# Altium schematic sheet EP1C6T144I8N.SchDoc: Sonar 4.4
size A2; ApprovedBy: Логвиненко; CheckedBy: Левинец; Author: Спеян; CompanyName: Garage; DrawnBy: 16; Engineer: ,; Organization: Device for; Address1: Protect During; Address2: a Zombie; Address3: Apocalypse; Address4: ....; DocumentNumber: Garage; Revision: 25; SheetNumber: 1; SheetTotal: 1; Scale: 1:1; Title2str: Сонар; ProcessInspection: EP1C6T144I8N.SchDoc; NormInspection: ,; Letter1Column: S; Letter2Column: -; Letter3Column: -; DocumentType: Схема електрическая принципиальная; Mass: .; FirstReferrence: SDE 525.1 111 017 ME; Grupa: gr. E-111; Time: Garage; Rule: 26; ImagePath: 18; Application_BuildNumber: 5
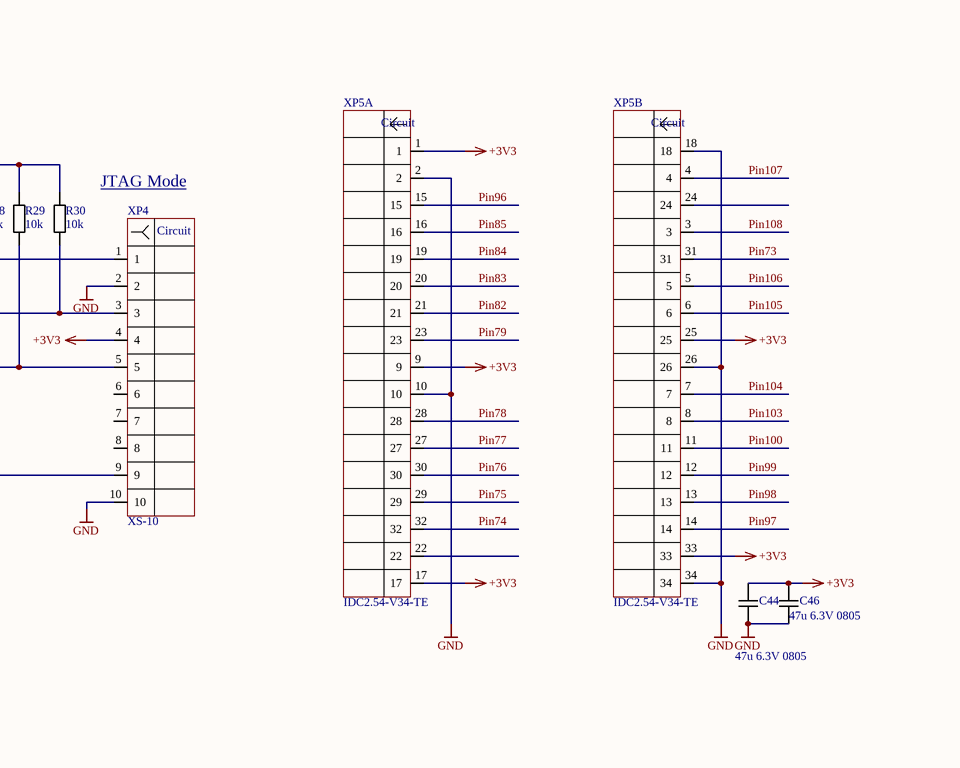
[diagram p0: EP1C6T144I8N.SchDoc, top right]
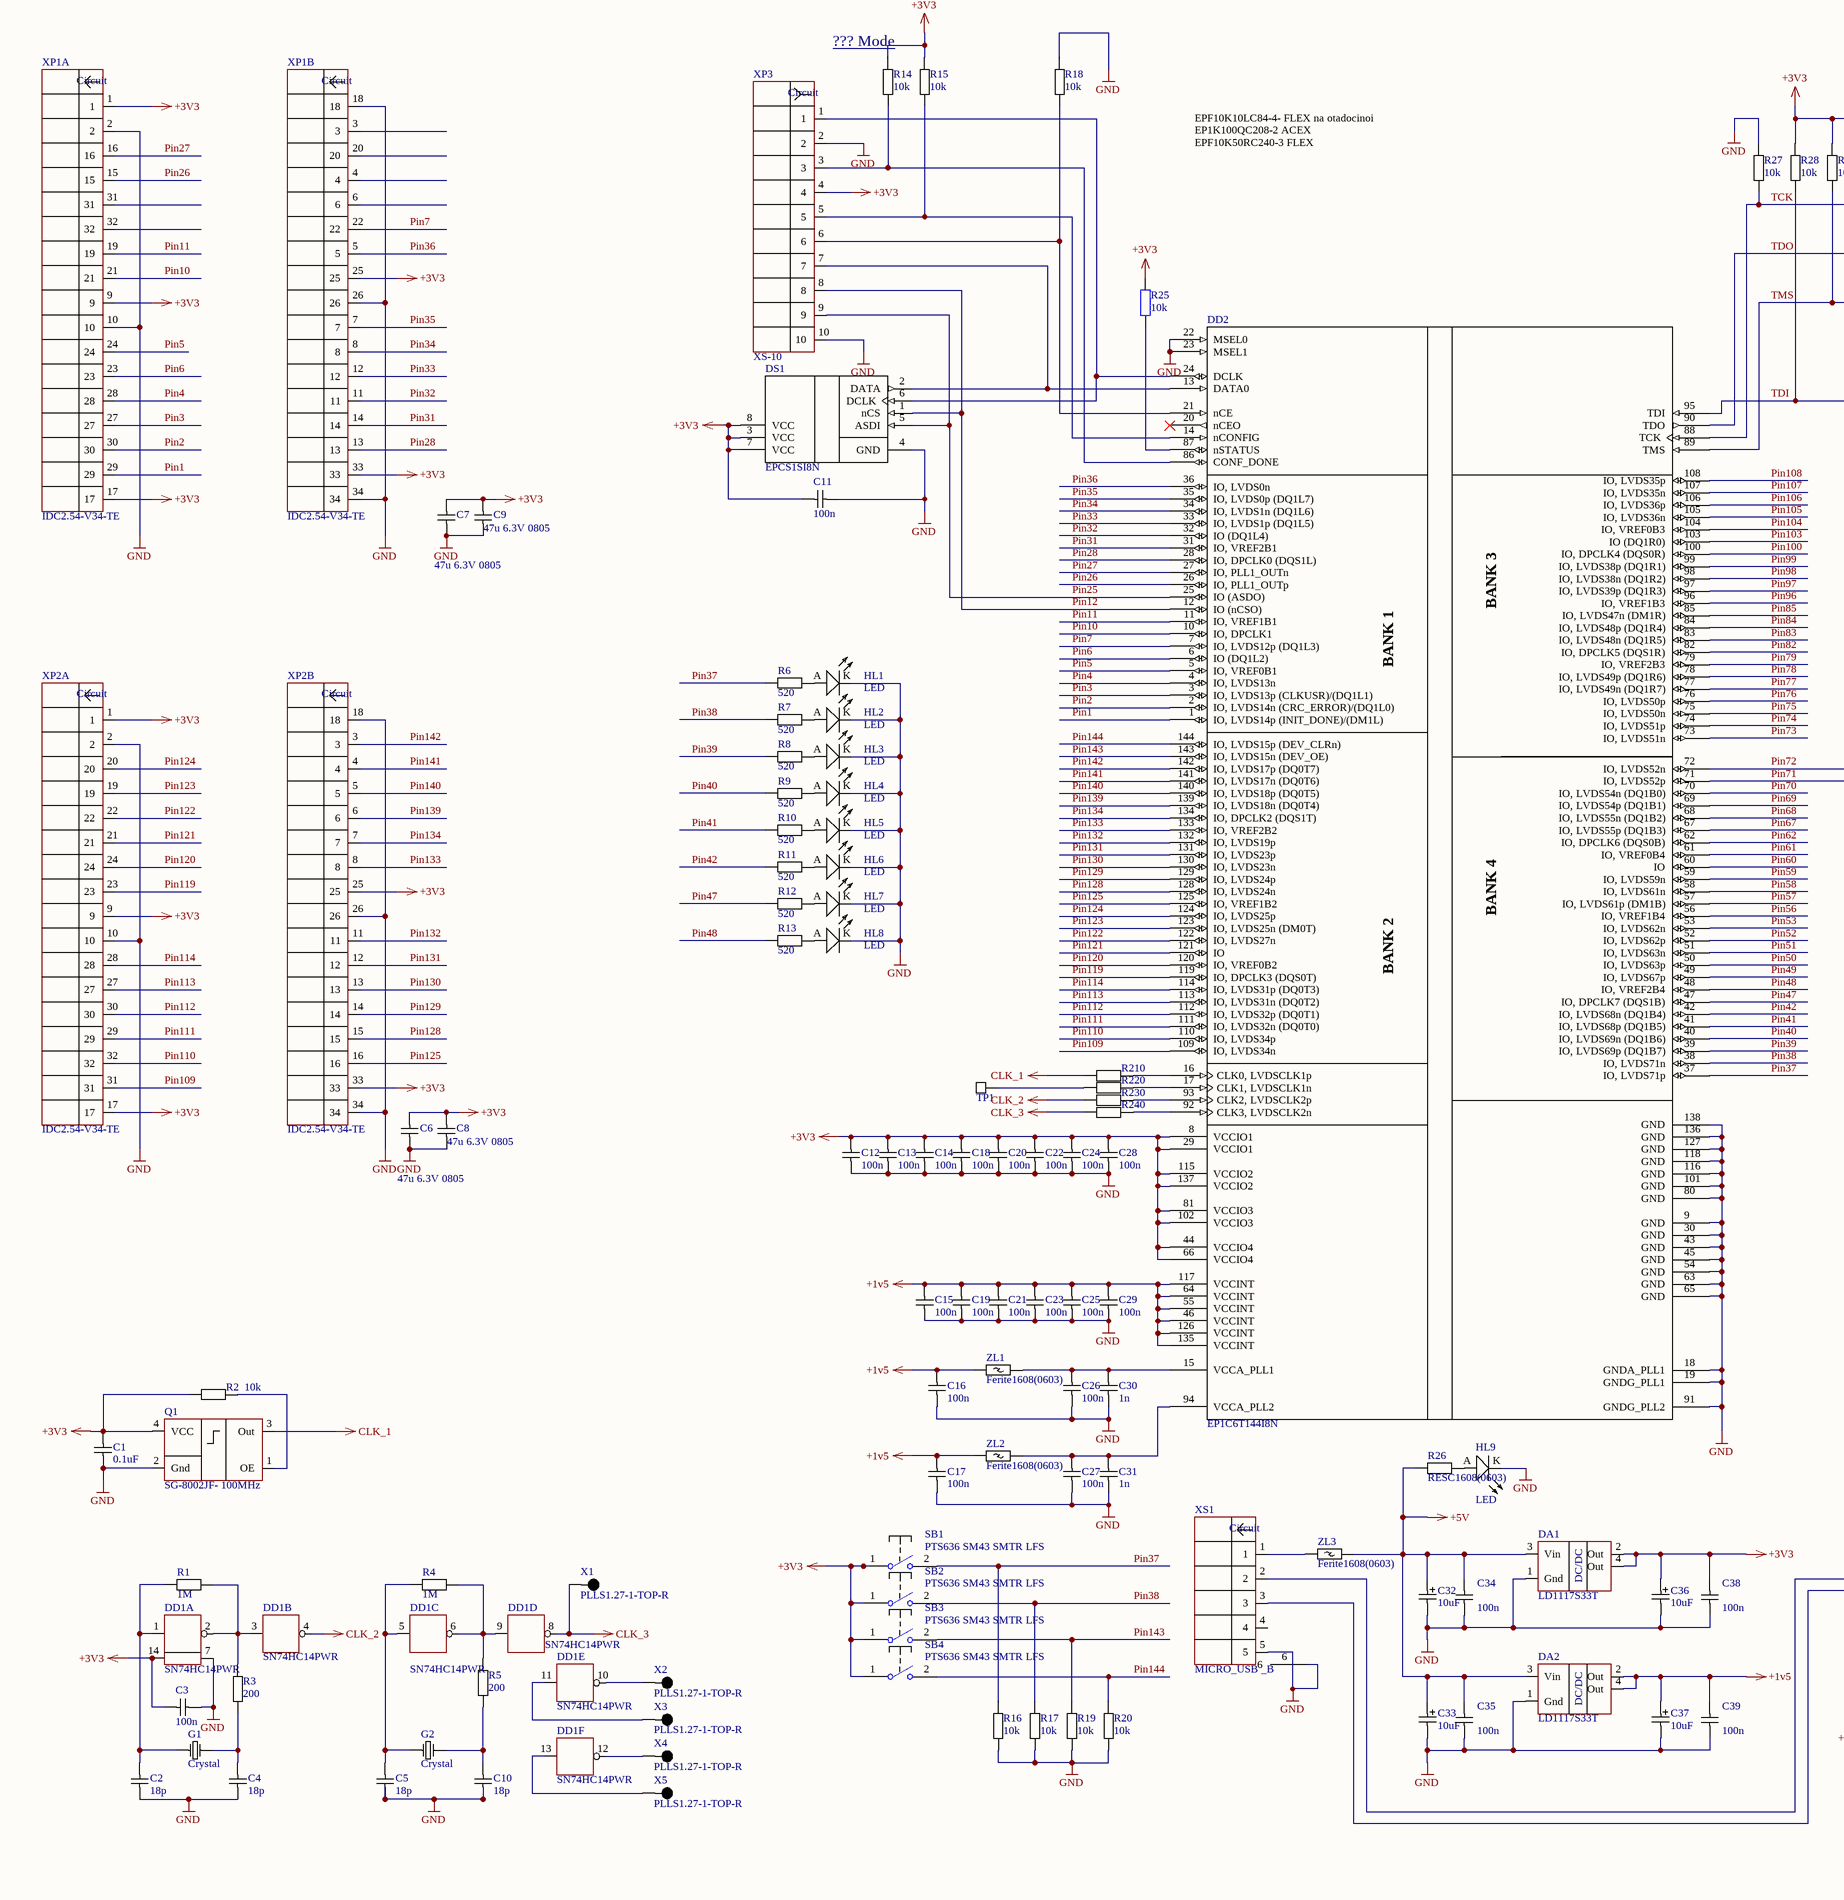
[diagram p1: EP1C6T144I8N.SchDoc, bottom left]
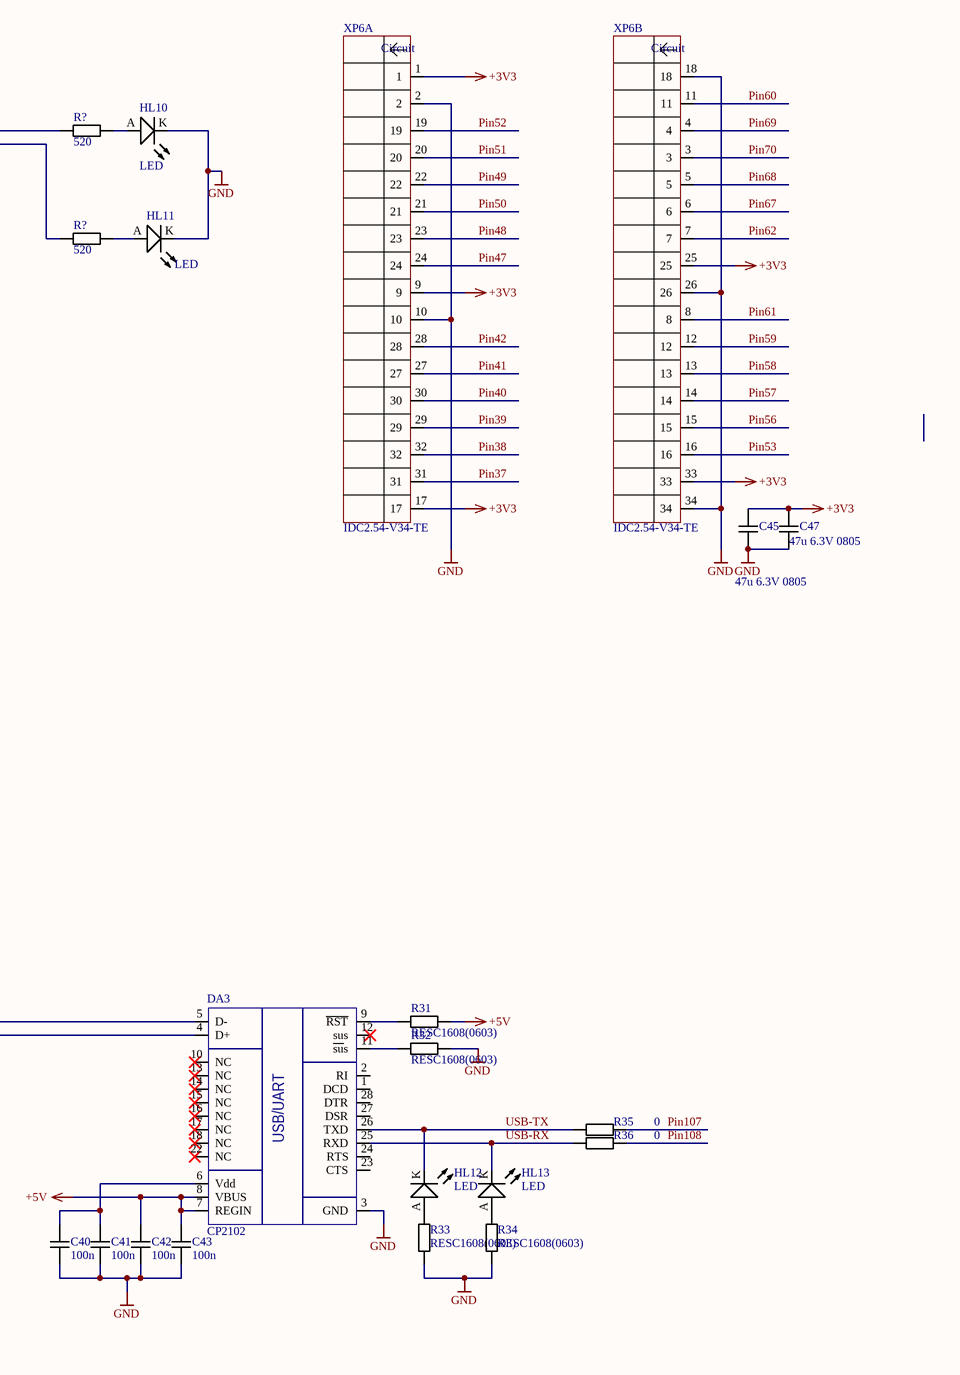
[diagram p2: EP1C6T144I8N.SchDoc, bottom right]

## Parts
(Parts that share a designator on the sheet are numbered #1, #2 ... from top to bottom, then left to right.)
C1  0.1uF  [CapKemet1005(0402)]
C2  18p  [CAPC1608(0603)N]
C3  100n  [CAPC1608(0603)N]
C4  18p  [CAPC1608(0603)N]
C5  18p  [CAPC1608(0603)N]
C6  47u 6.3V 0805  [CAPC2012(0805)N]
C7  47u 6.3V 0805  [CAPC2012(0805)N]
C8  47u 6.3V 0805  [CAPC2012(0805)N]
C9  47u 6.3V 0805  [CAPC2012(0805)N]
C10  18p  [CAPC1608(0603)N]
C11  100n  [CapKemet1005(0402)]
C12  100n  [CapKemet1005(0402)]
C13  100n  [CapKemet1005(0402)]
C14  100n  [CapKemet1005(0402)]
C15  100n  [CapKemet1005(0402)]
C16  100n  [CapKemet1005(0402)]
C17  100n  [CapKemet1005(0402)]
C18  100n  [CapKemet1005(0402)]
C19  100n  [CapKemet1005(0402)]
C20  100n  [CapKemet1005(0402)]
C21  100n  [CapKemet1005(0402)]
C22  100n  [CapKemet1005(0402)]
C23  100n  [CapKemet1005(0402)]
C24  100n  [CapKemet1005(0402)]
C25  100n  [CapKemet1005(0402)]
C26  100n  [CapKemet1005(0402)]
C27  100n  [CapKemet1005(0402)]
C28  100n  [CapKemet1005(0402)]
C29  100n  [CapKemet1005(0402)]
C30  1n  [CapKemet1005(0402)]
C31  1n  [CapKemet1005(0402)]
C32  10uF  [0402-A]
C33  10uF  [0402-A]
C34  100n  [CapKemet1005(0402)]
C35  100n  [CapKemet1005(0402)]
C36  10uF  [0402-A]
C37  10uF  [0402-A]
C38  100n  [CapKemet1005(0402)]
C39  100n  [CapKemet1005(0402)]
C40  100n  [CAPC1608(0603)N]
C41  100n  [CAPC1608(0603)N]
C42  100n  [CAPC1608(0603)N]
C43  100n  [CAPC1608(0603)N]
C44  47u 6.3V 0805  [CAPC2012(0805)N]
C45  47u 6.3V 0805  [CAPC2012(0805)N]
C46  47u 6.3V 0805  [CAPC2012(0805)N]
C47  47u 6.3V 0805  [CAPC2012(0805)N]
DA1  LD1117S33T  [SOT223_M]
DA2  LD1117S33T  [SOT223_M]
DA3  CP2102  [QFN28]
DD1  SN74HC14PWR  [TSSOP14]  (parts A,B,C,D,E,F of 6)
DD2  EP1C6T144I8N  [TQFP144_N]
DS1  EPCS1SI8N  [SO8_N]
G1  Crystal  [HC-49/S]
G2  Crystal  [HC-49/S]
HL1  LED  [LED-0603-GREEN]
HL2  LED  [LED-0603-GREEN]
HL3  LED  [LED-0603-GREEN]
HL4  LED  [LED-0603-GREEN]
HL5  LED  [LED-0603-GREEN]
HL6  LED  [LED-0603-GREEN]
HL7  LED  [LED-0603-GREEN]
HL8  LED  [LED-0603-GREEN]
HL9  LED  [LED-0603-GREEN]
HL10  LED  [LED-0603-GREEN]
HL11  LED  [LED-0603-BLUE]
HL12  LED  [LED-0603-BLUE]
HL13  LED  [LED-0603-GREEN]
Q1  SG-8002JF- 100MHz  [SG-8002JF]
R1  1M  [RESC1608(0603)N]
R2  10k  [RESC1608(0603)N]
R3  200  [RESC1608(0603)N]
R4  1M  [RESC1608(0603)N]
R5  200  [RESC1608(0603)N]
R6  520  [RESC1608(0603)N]
R7  520  [RESC1608(0603)N]
R8  520  [RESC1608(0603)N]
R9  520  [RESC1608(0603)N]
R10  520  [RESC1608(0603)N]
R11  520  [RESC1608(0603)N]
R12  520  [RESC1608(0603)N]
R13  520  [RESC1608(0603)N]
R14  10k  [RESC1608(0603)N]
R15  10k  [RESC1608(0603)N]
R16  10k  [RESC1608(0603)N]
R17  10k  [RESC1608(0603)N]
R18  10k  [RESC1608(0603)N]
R19  10k  [RESC1608(0603)N]
R20  10k  [RESC1608(0603)N]
R21  0  [RESC1608(0603)N]
R22  0  [RESC1608(0603)N]
R23  0  [RESC1608(0603)N]
R24  0  [RESC1608(0603)N]
R25  10k  [RESC1608(0603)N]
R26  RESC1608(0603)  [RESC1608(0603)N]
R27  10k  [RESC1608(0603)N]
R28  10k  [RESC1608(0603)N]
R29  10k  [RESC1608(0603)N]
R30  10k  [RESC1608(0603)N]
R31  RESC1608(0603)  [RESC1608(0603)N]
R32  RESC1608(0603)  [RESC1608(0603)N]
R33  RESC1608(0603)  [RESC1608(0603)N]
R34  RESC1608(0603)  [RESC1608(0603)N]
R35  0  [RESC1608(0603)N]
R36  0  [RESC1608(0603)N]
R?#1  520  [RESC1608(0603)N]
R?#2  520  [RESC1608(0603)N]
SB1  PTS636 SM43 SMTR LFS  [PTS636 SM43 SMTR LFS]
SB2  PTS636 SM43 SMTR LFS  [PTS636 SM43 SMTR LFS]
SB3  PTS636 SM43 SMTR LFS  [PTS636 SM43 SMTR LFS]
SB4  PTS636 SM43 SMTR LFS  [PTS636 SM43 SMTR LFS]
TP1  TP(No BOM)  [1.27-1-TOP-RR]  (value not drawn)  (no BOM)
X1  PLLS1.27-1-TOP-R  [PLLS1.27-1-TOP-R]
X2  PLLS1.27-1-TOP-R  [PLLS1.27-1-TOP-R]
X3  PLLS1.27-1-TOP-R  [PLLS1.27-1-TOP-R]
X4  PLLS1.27-1-TOP-R  [PLLS1.27-1-TOP-R]
X5  PLLS1.27-1-TOP-R  [PLLS1.27-1-TOP-R]
XP1  IDC2.54-V34-TE  [IDC2.54-V34-TE]  (parts A,B of 2)
XP2  IDC2.54-V34-TE  [IDC2.54-V34-TE]  (parts A,B of 2)
XP3  XS-10  [BH-10]
XP4  XS-10  [BH-10]
XP5  IDC2.54-V34-TE  [IDC2.54-V34-TE]  (parts A,B of 2)
XP6  IDC2.54-V34-TE  [IDC2.54-V34-TE]  (parts A,B of 2)
XS1  MICRO_USB _B  [MICRO_USB _B]
ZL1  Ferite1608(0603)  [INDC1608(0603)N]
ZL2  Ferite1608(0603)  [INDC1608(0603)N]
ZL3  Ferite1608(0603)  [INDC1608(0603)N]

## Nets
+1v5: C15.1 C16.1 C17.1 C19.1 C21.1 C23.1 C25.1 C29.1 C37.1 C39.2 DA2.2(Out) DA2.4(Out) DD2.46(VCCINT) DD2.55(VCCINT) DD2.64(VCCINT) DD2.117(VCCINT) DD2.126(VCCINT) DD2.135(VCCINT) ZL1.1 ZL2.1
+3V3: C1.2 C3.1 C6.2 C7.2 C8.2 C9.2 C11.2 C12.1 C13.1 C14.1 C18.1 C20.1 C22.1 C24.1 C28.1 C36.1 C38.2 C44.2 C45.2 C46.2 C47.2 DA1.2(Out) DA1.4(Out) DD1.14(VCC) DD2.8(VCCIO1) DD2.29(VCCIO1) DD2.44(VCCIO4) DD2.66(VCCIO4) DD2.81(VCCIO3) DD2.102(VCCIO3) DD2.115(VCCIO2) DD2.137(VCCIO2) DS1.3(VCC) DS1.7(VCC) DS1.8(VCC) Q1.4(VCC) R2.1 R14.2 R15.2 R25.2 R28.2 R29.2 R30.2 SB1.1(COMMON) SB2.1(COMMON) SB3.1(COMMON) SB4.1(COMMON) XP1.1 XP1.9 XP1.17 XP1.25 XP1.33 XP2.1 XP2.9 XP2.17 XP2.25 XP2.33 XP3.4 XP4.4 XP5.1 XP5.9 XP5.17 XP5.25 XP5.33 XP6.1 XP6.9 XP6.17 XP6.25 XP6.33
+5V: C32.1 C33.1 C34.2 C35.2 C42.2 C43.2 DA1.3(Vin) DA2.3(Vin) DA3.7(REGIN) DA3.8(VBUS) R26.2 R31.2 ZL3.2
CLK_1: Q1.3(Out) R21.1
CLK_2: DD1.4(2Y) R23.1
CLK_3: DD1.8(4Y) R24.1 X1.1
GND: C1.1 C2.1 C3.2 C4.1 C5.1 C6.1 C7.1 C8.1 C9.1 C10.1 C11.1 C12.2 C13.2 C14.2 C15.2 C16.2 C17.2 C18.2 C19.2 C20.2 C21.2 C22.2 C23.2 C24.2 C25.2 C26.2 C27.2 C28.2 C29.2 C30.2 C31.2 C32.2 C33.2 C34.1 C35.1 C36.2 C37.2 C38.1 C39.1 C40.1 C41.1 C42.1 C43.1 C44.1 C45.1 C46.1 C47.1 DA1.1(Gnd) DA2.1(Gnd) DA3.3(GND) DD1.7(GND) DD2.9(GND) DD2.18(GNDA_PLL1) DD2.19(GNDG_PLL1) DD2.22(MSEL0) DD2.23(MSEL1) DD2.30(GND) DD2.43(GND) DD2.45(GND) DD2.54(GND) DD2.63(GND) DD2.65(GND) DD2.80(GND) DD2.91(GNDG_PLL2) DD2.101(GND) DD2.116(GND) DD2.118(GND) DD2.127(GND) DD2.136(GND) DD2.138(GND) DS1.4(GND) HL1.K HL2.K HL3.K HL4.K HL5.K HL6.K HL7.K HL8.K HL9.K HL10.K HL11.K Q1.2(Gnd) R16.1 R17.1 R18.2 R19.1 R20.1 R27.2 R32.1 R33.2 R34.2 XP1.2 XP1.10 XP1.18 XP1.26 XP1.34 XP2.2 XP2.10 XP2.18 XP2.26 XP2.34 XP3.2 XP3.10 XP4.2 XP4.10 XP5.2 XP5.10 XP5.18 XP5.26 XP5.34 XP6.2 XP6.10 XP6.18 XP6.26 XP6.34 XS1.5 XS1.6
Pin1: DD2.1(IO,_LVDS14p_(INIT_DONE)/(DM1L)) XP1.29
Pin2: DD2.2(IO,_LVDS14n_(CRC_ERROR)/(DQ1L0)) XP1.30
Pin3: DD2.3(IO,_LVDS13p_(CLKUSR)/(DQ1L1)) XP1.27
Pin4: DD2.4(IO,_LVDS13n) XP1.28
Pin5: DD2.5(IO,_VREF0B1) XP1.24
Pin6: DD2.6(IO_(DQ1L2)) XP1.23
Pin7: DD2.7(IO,_LVDS12p_(DQ1L3)) XP1.22
Pin10: DD2.10(IO,_DPCLK1) XP1.21
Pin11: DD2.11(IO,_VREF1B1) XP1.19
Pin12: DD2.12(IO_(nCSO)) DS1.1(nCS) XP3.8
Pin25: DD2.25(IO_(ASDO)) DS1.5(ASDI) XP3.9
Pin26: DD2.26(IO,_PLL1_OUTp) XP1.15
Pin27: DD2.27(IO,_PLL1_OUTn) XP1.16
Pin28: DD2.28(IO,_DPCLK0_(DQS1L)) XP1.13
Pin31: DD2.31(IO,_VREF2B1) XP1.14
Pin32: DD2.32(IO_(DQ1L4)) XP1.11
Pin33: DD2.33(IO,_LVDS1p_(DQ1L5)) XP1.12
Pin34: DD2.34(IO,_LVDS1n_(DQ1L6)) XP1.8
Pin35: DD2.35(IO,_LVDS0p_(DQ1L7)) XP1.7
Pin36: DD2.36(IO,_LVDS0n) XP1.5
Pin37: DD2.37(IO,_LVDS71p) R6.2 R16.2 SB1.2(NO) XP6.31
Pin38: DD2.38(IO,_LVDS71n) R7.2 R17.2 SB2.2(NO) XP6.32
Pin39: DD2.39(IO,_LVDS69p_(DQ1B7)) R8.2 XP6.29
Pin40: DD2.40(IO,_LVDS69n_(DQ1B6)) R9.2 XP6.30
Pin41: DD2.41(IO,_LVDS68p_(DQ1B5)) R10.2 XP6.27
Pin42: DD2.42(IO,_LVDS68n_(DQ1B4)) R11.2 XP6.28
Pin47: DD2.47(IO,_DPCLK7_(DQS1B)) R12.2 XP6.24
Pin48: DD2.48(IO,_VREF2B4) R13.2 XP6.23
Pin49: DD2.49(IO,_LVDS67p) XP6.22
Pin50: DD2.50(IO,_LVDS63p) XP6.21
Pin51: DD2.51(IO,_LVDS63n) XP6.20
Pin52: DD2.52(IO,_LVDS62p) XP6.19
Pin53: DD2.53(IO,_LVDS62n) XP6.16
Pin56: DD2.56(IO,_VREF1B4) XP6.15
Pin57: DD2.57(IO,_LVDS61p_(DM1B)) XP6.14
Pin58: DD2.58(IO,_LVDS61n) XP6.13
Pin59: DD2.59(IO,_LVDS59n) XP6.12
Pin60: DD2.60(IO) XP6.11
Pin61: DD2.61(IO,_VREF0B4) XP6.8
Pin62: DD2.62(IO,_DPCLK6_(DQS0B)) XP6.7
Pin67: DD2.67(IO,_LVDS55p_(DQ1B3)) XP6.6
Pin68: DD2.68(IO,_LVDS55n_(DQ1B2)) XP6.5
Pin69: DD2.69(IO,_LVDS54p_(DQ1B1)) XP6.4
Pin70: DD2.70(IO,_LVDS54n_(DQ1B0)) XP6.3
Pin71: DD2.71(IO,_LVDS52p) R?#2.2
Pin72: DD2.72(IO,_LVDS52n) R?#1.2
Pin73: DD2.73(IO,_LVDS51n) XP5.31
Pin74: DD2.74(IO,_LVDS51p) XP5.32
Pin75: DD2.75(IO,_LVDS50n) XP5.29
Pin76: DD2.76(IO,_LVDS50p) XP5.30
Pin77: DD2.77(IO,_LVDS49n_(DQ1R7)) XP5.27
Pin78: DD2.78(IO,_LVDS49p_(DQ1R6)) XP5.28
Pin79: DD2.79(IO,_VREF2B3) XP5.23
Pin82: DD2.82(IO,_DPCLK5_(DQS1R)) XP5.21
Pin83: DD2.83(IO,_LVDS48n_(DQ1R5)) XP5.20
Pin84: DD2.84(IO,_LVDS48p_(DQ1R4)) XP5.19
Pin85: DD2.85(IO,_LVDS47n_(DM1R)) XP5.16
Pin96: DD2.96(IO,_VREF1B3) XP5.15
Pin97: DD2.97(IO,_LVDS39p_(DQ1R3)) XP5.14
Pin98: DD2.98(IO,_LVDS38n_(DQ1R2)) XP5.13
Pin99: DD2.99(IO,_LVDS38p_(DQ1R1)) XP5.12
Pin100: DD2.100(IO,_DPCLK4_(DQS0R)) XP5.11
Pin103: DD2.103(IO_(DQ1R0)) XP5.8
Pin104: DD2.104(IO,_VREF0B3) XP5.7
Pin105: DD2.105(IO,_LVDS36n) XP5.6
Pin106: DD2.106(IO,_LVDS36p) XP5.5
Pin107: DD2.107(IO,_LVDS35n) R35.2 XP5.4
Pin108: DD2.108(IO,_LVDS35p) R36.2 XP5.3
Pin109: DD2.109(IO,_LVDS34n) XP2.31
Pin110: DD2.110(IO,_LVDS34p) XP2.32
Pin111: DD2.111(IO,_LVDS32n_(DQ0T0)) XP2.29
Pin112: DD2.112(IO,_LVDS32p_(DQ0T1)) XP2.30
Pin113: DD2.113(IO,_LVDS31n_(DQ0T2)) XP2.27
Pin114: DD2.114(IO,_LVDS31p_(DQ0T3)) XP2.28
Pin119: DD2.119(IO,_DPCLK3_(DQS0T)) XP2.23
Pin120: DD2.120(IO,_VREF0B2) XP2.24
Pin121: DD2.121(IO) XP2.21
Pin122: DD2.122(IO,_LVDS27n) XP2.22
Pin123: DD2.123(IO,_LVDS25n_(DM0T)) XP2.19
Pin124: DD2.124(IO,_LVDS25p) XP2.20
Pin125: DD2.125(IO,_VREF1B2) XP2.16
Pin128: DD2.128(IO,_LVDS24n) XP2.15
Pin129: DD2.129(IO,_LVDS24p) XP2.14
Pin130: DD2.130(IO,_LVDS23n) XP2.13
Pin131: DD2.131(IO,_LVDS23p) XP2.12
Pin132: DD2.132(IO,_LVDS19p) XP2.11
Pin133: DD2.133(IO,_VREF2B2) XP2.8
Pin134: DD2.134(IO,_DPCLK2_(DQS1T)) XP2.7
Pin139: DD2.139(IO,_LVDS18n_(DQ0T4)) XP2.6
Pin140: DD2.140(IO,_LVDS18p_(DQ0T5)) XP2.5
Pin141: DD2.141(IO,_LVDS17n_(DQ0T6)) XP2.4
Pin142: DD2.142(IO,_LVDS17p_(DQ0T7)) XP2.3
Pin143: DD2.143(IO,_LVDS15n_(DEV_OE)) R19.2 SB3.2(NO)
Pin144: DD2.144(IO,_LVDS15p_(DEV_CLRn)) R20.2 SB4.2(NO)
TCK: DD2.88(TCK) R27.1 XP4.1
TDI: DD2.95(TDI) R28.1 XP4.9
TDO: DD2.90(TDO) R30.1 XP4.3
TMS: DD2.89(TMS) R29.1 XP4.5
USB-RX: DA3.25(RXD) HL13.K R36.1
USB-TX: DA3.26(TXD) HL12.K R35.1
NetC2_2: C2.2 DD1.1(1A) G1.1 R1.1
NetC4_2: C4.2 G1.2 R3.1
NetC5_2: C5.2 DD1.5(3A) G2.1 R4.1
NetC10_2: C10.2 G2.2 R5.1
NetC26_1: C26.1 C30.1 DD2.15(VCCA_PLL1) ZL1.2
NetC27_1: C27.1 C31.1 DD2.94(VCCA_PLL2) ZL2.2
NetC40_2: C40.2 C41.2 DA3.6(Vdd)
NetDA3_4: DA3.4(D+) XS1.3
NetDA3_5: DA3.5(D-) XS1.2
NetDA3_9: DA3.9(~{RST}) R31.1
NetDA3_11: DA3.11(~{su}s) R32.2
NetDD1_2: DD1.2(1Y) DD1.3(2A) R1.2 R3.2
NetDD1_6: DD1.6(3Y) DD1.9(4A) R4.2 R5.2
NetDD1_10: DD1.10(5Y) X2.1
NetDD1_11: DD1.11(5A) X3.1
NetDD1_12: DD1.12(6Y) X4.1
NetDD1_13: DD1.13(6A) X5.1
NetDD2_13: DD2.13(DATA0) DS1.2(DATA) XP3.7
NetDD2_14: DD2.14(nCONFIG) R15.1 XP3.5
NetDD2_16: DD2.16(CLK0,_LVDSCLK1p) R21.2
NetDD2_17: DD2.17(CLK1,_LVDSCLK1n) R22.2
NetDD2_21: DD2.21(nCE) R18.1 XP3.6
NetDD2_24: DD2.24(DCLK) DS1.6(DCLK) XP3.1
NetDD2_86: DD2.86(CONF_DONE) R14.1 XP3.3
NetDD2_87: DD2.87(nSTATUS) R25.1
NetDD2_92: DD2.92(CLK3,_LVDSCLK2n) R24.2
NetDD2_93: DD2.93(CLK2,_LVDSCLK2p) R23.2
NetHL1_A: HL1.A R6.1
NetHL2_A: HL2.A R7.1
NetHL3_A: HL3.A R8.1
NetHL4_A: HL4.A R9.1
NetHL5_A: HL5.A R10.1
NetHL6_A: HL6.A R11.1
NetHL7_A: HL7.A R12.1
NetHL8_A: HL8.A R13.1
NetHL9_A: HL9.A R26.1
NetHL10_A: HL10.A R?#1.1
NetHL11_A: HL11.A R?#2.1
NetHL12_A: HL12.A R33.1
NetHL13_A: HL13.A R34.1
NetQ1_1: Q1.1(OE) R2.2
NetR22_1: R22.1 TP1.1
NetXS1_1: XS1.1 ZL3.1

Not connected (* = marked no-connect by the designer): DA3 1(DCD) 2(RI) 10(NC)* 12(sus)* 13(NC)* 14(NC)* 15(NC)* 16(NC)* 17(NC)* 18(NC)* 22(NC)* 23(CTS) 24(RTS) 27(DSR) 28(DTR); DD2 20(nCEO)*; XP1 3 4 6 20 31 32; XP4 6 7 8; XP5 22 24; XS1 4

## Notes on the sheet
- ??? Mode
- JTAG Mode
- EPF10K10LC84-4- FLEX na otadocinoi
  EP1K100QC208-2 ACEX
  EPF10K50RC240-3 FLEX
- Title
- Size:
- Date:
- File:
- A2
- Number:
- Time:
- Revision:
- Sheet
- of
- (in symbol 3220-10-0100-00) Circuit
- (in symbol CP2102) USB/UART
- (in symbol EP1C6T144I8N) BANK 1; BANK 3; BANK 2; BANK 4
- (in symbol IDC2.54-V34-TE, part A) Circuit
- (in symbol IDC2.54-V34-TE, part B) Circuit
- (in symbol LD1117S33T) DC/DC
- (in symbol MICRO_USB _B) Circuit

## Library data of the parts
C1 C11-C31 C34 C35 C38 C39 = CAPC1005(0402)N: Part Number: CAPC1005(0402)N; Digi-Key Part Number: ?; HelpURL: ?; Manufacturer Part Number: ?; Note: ?; Package: ?; Price$: ?
C2-C5 C10 C40-C43 = CAPC1608(0603): ?; Part Number: CAPC1608(0603); HelpURL: ?; Digi-Key Part Number: ?; Price$: ?; Note: ?; Manufacturer Part Number: ?; Package: ?
C6-C9 C44-C47 = CAPC2012(0805): CAP CER 47UF 6.3V X5R 0805; Manufacturer Part Number: GRM219R60J476ME44D; Part Number: CAPC2012(0805); HelpURL: https://www.digikey.com/product-detail/en/murata-electronics/GRM219R60J476ME44D/490-13249-1-ND/5877457; Digi-Key Part Number: 490-13249-1-ND; Price$: 0.64; Package: 0805; Parameter 2: *
C32 C33 C36 C37 = CapTantA: Part Number: CapTantA
DD1 = SN74HC14PWR: IC INVERTER SCHMITT 6CH 14TSSOP; Part Number: SN74HC14PWR; HelpURL: https://www.digikey.com/product-detail/en/texas-instruments/SN74HC14PWR/296-8234-1-ND/376675
DS1 = EPCS1SI8N: IC CONFIG DEVICE 1MBIT 8SOIC; Configures: Cyclone II, Stratix II, & Cyclone Devices; Published: 17-Sep-2003; LatestRevisionDate: 13-Apr-2006; LatestRevisionNote: IPC-7351 Footprint Added.; DatasheetVersion: ver2.0, Oct-2003; PackageVersion: ver14.2, Oct-2005; PackageReference: SOIC8; Publisher: Altium Limited; PackageDescription: 8-Pin Small Outline Integrated Circuit Package (SOIC8); Supplier 1: Digi-Key; Supplier Part Number 1: 544-1241-5-ND; Code_JEDEC: MS-012-AA; Code_IPC: SOIC127P600-8; ComponentLink1Description: Manufacturer Link; ComponentLink1URL: http://www.altera.com/products/devices/config/cfg-index.html; ComponentLink2Description: Configuration Handbook; ComponentLink2URL: http://www.altera.com/literature/hb/cfg/config_handbook.pdf; ComponentLink3Description: Pinout Specification; ComponentLink3URL: http://www.altera.com/literature/hb/cfg/cyc_c51014.pdf; ComponentLink4Description: Packaging Specification; ComponentLink4URL: http://www.altera.com/literature/ds/dspkg.pdf; Part Number: EPCS1SI8N; HelpURL: https://www.altera.com/en_US/pdfs/literature/hb/cfg/cyc_c51014.pdf; Price$: 4.02
G1 G2 = Crystal HC-49/S: Part Number: Crystal HC-49/S
HL1 HL7-HL10 HL13 = LED-0603-GREEN: LED GREEN DIFFUSED 0603 SMD; Manufacturer Part Number: 150060VS55040; Part Number: LED-0603-GREEN; HelpURL: https://www.digikey.com/products/en?keywords=732-12017-1-ND; Digi-Key Part Number: 732-12017-1-ND; Price$: ?; Note: ?; Package: ?
HL2-HL6 HL11 HL12 = LED-0603-BLUE: LED BLUE DIFFUSED 0603 SMD; Manufacturer Part Number: 150060BS55040; Part Number: LED-0603-BLUE; HelpURL: https://www.digikey.com/products/en?keywords=732-12013-1-ND; Digi-Key Part Number: 732-12013-1-ND; Price$: ?; Note: ?; Package: 0603
Q1 = SG-8002JF: Part Number: SG-8002JF
R1 R3-R13 R21-R24 R26 R31-R36 R?#1 R?#2 = RESC1608(0603): Note: ???; Part Number: RESC1608(0603); HelpURL: ???; Digi-Key Part Number: ???; Price$: ???; Manufacturer Part Number: ???; Package: ???
R2 R14-R20 R27-R30 = RESC1005(0402): Note: ???; Part Number: RESC1005(0402); HelpURL: ???; Digi-Key Part Number: ???; Price$: ???; Manufacturer Part Number: ???; Package: ???
R25 = RESC1005(0402): Resistor; Manufacturer Part Number: ???; Part Number: RESC1005(0402); Digi-Key Part Number: ???; HelpURL: ???; Note: ???; Package: ???; Price$: ???
SB1-SB4 = PTS636 SM43 SMTR LFS: Tactile Switches Tact 50mA 12VDC, 6.0x3.5, 4.3mm H, 180gf, G leads, No ground pin, Black Actuator; Part Number: PTS636 SM43 SMTR LFS; HelpURL: https://eu.mouser.com/ProductDetail/CK/PTS636-SM43-SMTR-LFS?qs=sGAEpiMZZMsgGjVA3toVBC4OPD95ORcgaeKhIDqe9Es%3D; Price$: 0.11; Manufacturer Part Number: PTS636 SM43 SMTR LFS; Package: 2pinSMD; Mouser Part Number: 611-PTS636SM43SMTRLF
TP1 = TP-1.27-1-TOP-RR: Part Number: TP-1.27-1-TOP-RR
XP3 XP4 = 3220-10-0100-00: Part Number: 3220-10-0100-00; Digi-Key Part Number: 1175-1627-ND; HelpURL: https://www.digikey.com/product-detail/en/cnc-tech/3220-10-0100-00/1175-1627-ND/3883661
XS1 = MICRO_USB _B: Note: ???; Part Number: MICRO_USB _B; HelpURL: https://www.digikey.com/product-detail/en/amphenol-icc-fci/10118194-0001LF/609-4618-1-ND/2785382; Digi-Key Part Number: ???; Price$: ???; Manufacturer Part Number: ???; Package: ???
ZL1-ZL3 = Ferite1608(0603): ferite bead; Note: ???; Part Number: Ferite1608(0603); Digi-Key Part Number: ???; Price$: ???; Manufacturer Part Number: ???; Package: ???
DA1 DA2 = LD1117S33T: Part Number: LD1117S33T; HelpURL: http://www.mouser.com/ds/2/389/CD00000544-310772.pdf
DA3 = CP2102: Part Number: CP2102; HelpURL: https://www.sparkfun.com/datasheets/IC/cp2102.pdf
DD2 = EP1C6T144I8N: Published: 18-Aug-2005; LatestRevisionDate: 13-Apr-2006; LatestRevisionNote: Pin 2 name fix, IPC-7351 Footprint Added.; DatasheetVersion: ver2.4, May-2008; PackageVersion: ver15.4, Dec-2008; PackageReference: TQFP144; Publisher: Altium Limited; PackageDescription: 144-Pin Plastic Thin Quad Flat Pack (TQFP144) - Wire Bond; Code_JEDEC: MS-026-BFB; ComponentLink1Description: Manufacturer Link; ComponentLink1URL: http://www.altera.com/products/devices/cyclone/cyc-index.jsp; ComponentLink2Description: Handbook; ComponentLink2URL: http://www.altera.com/literature/hb/cyc/cyc_c5v1.pdf; ComponentLink3Description: Packaging Specification; ComponentLink3URL: http://www.altera.com/literature/ds/dspkg.pdf; Part Number: EP1C6T144I8N
X1-X5 = PLLS1.27-1-TOP-R: Part Number: PLLS1.27-1-TOP-R
XP1 XP2 XP5 XP6 = IDC2.54-V34-TE: Part Number: IDC2.54-V34-TE